# EAGLE design USBReallyTinyISPv1 (EAGLE 7.4.0)
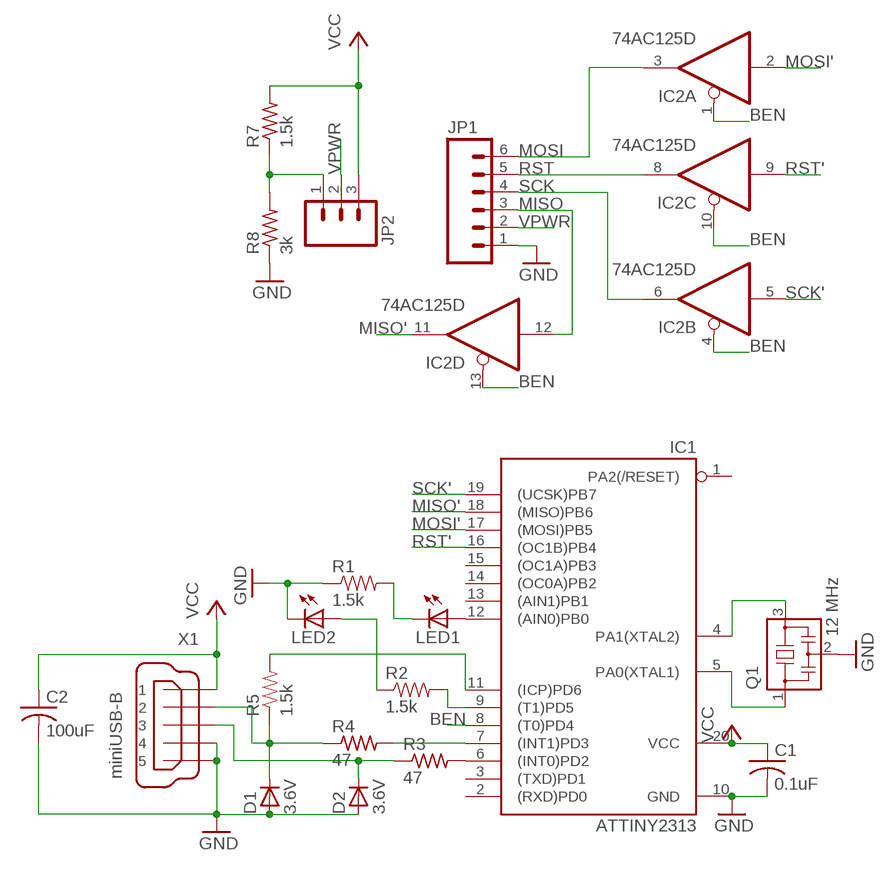
[diagram p0: schematic, sheet 1]

## Parts
C1  0.1uF  C-USC0805  [C0805]
C2  100uF  C-USC1206  [C1206]
D1  3.6V  DIODE_SOD-123  [SOD3718X135N]
D2  3.6V  DIODE_SOD-123  [SOD3718X135N]
IC1  ATTINY2313  TINY2313-*S*  [SO20L$]
IC2  74AC125D  [SO14]
JP1  M06SILK_FEMALE_PTH  [1X06]
JP2  M03-SHORTEDPTH  [1X03]
LED1  LEDSML0805  [SML0805]
LED2  LEDSML0805  [SML0805]
Q1  12 MHz  CSTCR6M00G53Z  [CSTCR6M]
R1  1.5k  RESISTOR1206  [1206]
R2  1.5k  RESISTOR1206  [1206]
R3  47  R-US_R0805  [R0805]
R4  47  R-US_R0805  [R0805]
R5  1.5k  RESISTOR1206  [1206]
R7  1.5k  R-US_R0805  [R0805]
R8  3k  R-US_R0805  [R0805]
X1  miniUSB-B  MINI-USB-UX60A-MB-5ST  [UX60A-MB-5ST]

## Nets
BEN: IC1.8((T0)PD4) IC2.1(A:OE) IC2.4(B:OE) IC2.10(C:OE) IC2.13(D:OE)
GND: C1.2 C2.2 D1.A D2.A IC1.10(GND) JP1.1 LED2.C Q1.2 R1.1 R8.1 X1.4 X1.5
MISO: IC2.12(D:I) JP1.3
MISO': IC1.18((MISO)PB6) IC2.11(D:O)
MOSI: IC2.3(A:O) JP1.6
MOSI': IC1.17((MOSI)PB5) IC2.2(A:I)
N$1: IC1.12((AIN0)PB0) LED1.A
N$2: IC1.4(PA1(XTAL2)) Q1.3
N$3: IC1.5(PA0(XTAL1)) Q1.1
N$4: IC1.9((T1)PD5) R2.2
N$6: LED2.A R2.1
N$7: LED1.C R1.2
N$8: IC1.6((INT0)PD2) R3.2
N$9: IC1.7((INT1)PD3) R4.2
N$10: D2.K R3.1 X1.3
N$11: D1.K R4.1 R5.1 X1.2
N$14: IC1.11((ICP)PD6) R5.2
N$15: JP2.1 R7.1 R8.2
RST: IC2.8(C:O) JP1.5
RST': IC1.16((OC1B)PB4) IC2.9(C:I)
SCK: IC2.6(B:O) JP1.4
SCK': IC1.19((UCSK)PB7) IC2.5(B:I)
VCC: C1.1 C2.1 IC1.20(VCC) JP2.3 R7.2 X1.1
VPWR: JP1.2 JP2.2
Unconnected: IC1.1(PA2(/RESET)) IC1.2((RXD)PD0) IC1.3((TXD)PD1) IC1.13((AIN1)PB1) IC1.14((OC0A)PB2) IC1.15((OC1A)PB3)

## Power pins joined to a net without a drawn wire
GND: IC2.7(P:GND)
VCC: IC2.14(P:VCC)

## Library data of the parts
C1 = adafruit:C-US: CAPACITOR, American symbol
C2 = resistor:C-US: CAPACITOR, American symbol
D1 D2 = ipc-7351-diode:DIODE_
IC1 = avr-7:TINY2313*: Atmel Tiny2313 2K Flash, 128 bytes EEPROM, 128 bytes RAM
IC2 = 74xx-eu:74*125: Quad bus BUFFER, 3-state
JP1 = SparkFun-Connectors:M06: Header 6 Standard 6-pin 0.1" header. Use with straight break away headers (SKU : PRT-00116), right angle break away headers (PRT-00553), swiss pins (PRT-00743), machine pins (PRT-00117), and female headers (PRT-00115). Molex polarized connector foot print use with SKU : PRT-08094 with associated crimp pins and housings. NOTES ON THE VARIANTS LOCK and LOCK_LONGPADS... This footprint was designed to help hold the alignment of a through-hole component (i.e. 6-pin header) while soldering it into place. You may notice that each hole has been shifted either up or down by 0.005 of an inch from it's more standard position (which is a perfectly straight line). This slight alteration caused the pins (the squares in the middle) to touch the edges of the holes. Because they are alternating, it causes a "brace" to hold the component in place. 0.005 has proven to be the perfect amount of "off-center" position when using our standard breakaway headers. Although looks a little odd when you look at the bare footprint, once you have a header in there, the alteration is very hard to notice. Also,if you push a header all the way into place, it is covered up entirely on the bottom side. This idea of altering the position of holes to aid alignment will be further integrated into the Sparkfun Library for other footprints. It can help hold any component with 3 or more connection pins.; PROD_ID: CONN-08437
JP2 = mine:M03-SHORTED: Header 3 Standard 3-pin 0.1" header. Use with straight break away headers (SKU : PRT-00116), right angle break away headers (PRT-00553), swiss pins (PRT-00743), machine pins (PRT-00117), and female headers (PRT-00115). Molex polarized connector foot print use with SKU : PRT-08232 with associated crimp pins and housings.
LED1 LED2 = led:LED: LED OSRAM: - CHIPLED LG R971, LG N971, LY N971, LG Q971, LY Q971, LO R971, LY R971 LH N974, LH R974 LS Q976, LO Q976, LY Q976 LO Q996 - Hyper CHIPLED LW Q18S LB Q993, LB Q99A, LB R99A - SideLED LS A670, LO A670, LY A670, LG A670, LP A670 LB A673, LV A673, LT A673, LW A673 LH A674 LY A675 LS A676, LA A676, LO A676, LY A676, LW A676 LS A679, LY A679, LG A679 - Hyper Micro SIDELED® LS Y876, LA Y876, LO Y876, LY Y876 LT Y87S - SmartLED LW L88C, LW L88S LB L89C, LB L89S, LG L890 LS L89K, LO L89K, LY L89K LS L896, LA L896, LO L896, LY L896 - TOPLED LS T670, LO T670, LY T670, LG T670, LP T670 LSG T670, LSP T670, LSY T670, LOP T670, LYG T670 LG T671, LOG T671, LSG T671 LB T673, LV T673, LT T673, LW T673 LH T674 LS T676, LA T676, LO T676, LY T676, LB T676, LH T676, LSB T676, LW T676 LB T67C, LV T67C, LT T67C, LS T67K, LO T67K, LY T67K, LW E67C LS E67B, LA E67B, LO E67B, LY E67B, LB E67C, LV E67C, LT E67C LW T67C LS T679, LY T679, LG T679 LS T770, LO T770, LY T770, LG T770, LP T770 LB T773, LV T773, LT T773, LW T773 LH T774 LS E675, LA E675, LY E675, LS T675 LS T776, LA T776, LO T776, LY T776, LB T776 LHGB T686 LT T68C, LB T68C - Hyper Mini TOPLED® LB M676 - Mini TOPLED Santana® LG M470 LS M47K, LO M47K, LY M47K Source: http://www.osram.convergy.de LUXEON: - LUMILED® LXK2-PW12-R00, LXK2-PW12-S00, LXK2-PW14-U00, LXK2-PW14-V00 LXK2-PM12-R00, LXK2-PM12-S00, LXK2-PM14-U00 LXK2-PE12-Q00, LXK2-PE12-R00, LXK2-PE12-S00, LXK2-PE14-T00, LXK2-PE14-U00 LXK2-PB12-K00, LXK2-PB12-L00, LXK2-PB12-M00, LXK2-PB14-N00, LXK2-PB14-P00, LXK2-PB14-Q00 LXK2-PR12-L00, LXK2-PR12-M00, LXK2-PR14-Q00, LXK2-PR14-R00 LXK2-PD12-Q00, LXK2-PD12-R00, LXK2-PD12-S00 LXK2-PH12-R00, LXK2-PH12-S00 LXK2-PL12-P00, LXK2-PL12-Q00, LXK2-PL12-R00 Source: www.luxeon.com KINGBRIGHT: KA-3528ASYC Source: www.kingbright.com
Q1 = murata-filter:CSTCR: Resonator Source: murata.co.jp; MPN: CSTCR6M00G53-R0; OC_FARNELL: 1170434; OC_NEWARK: 25M8759
R1 R2 R5 = SparkFun-Resistors:RESISTOR: Resistor Basic schematic elements and footprints for 0603, 1206, and PTH resistors.
R3 R4 R7 R8 = resistor:R-US_: RESISTOR, American symbol
X1 = con-hirose:MINI-USB-: MINI USB Connector Source: http://www.hirose.co.jp/cataloge_hp/e24000019.pdf; OC_FARNELL: unknown; OC_NEWARK: unknown

## Board
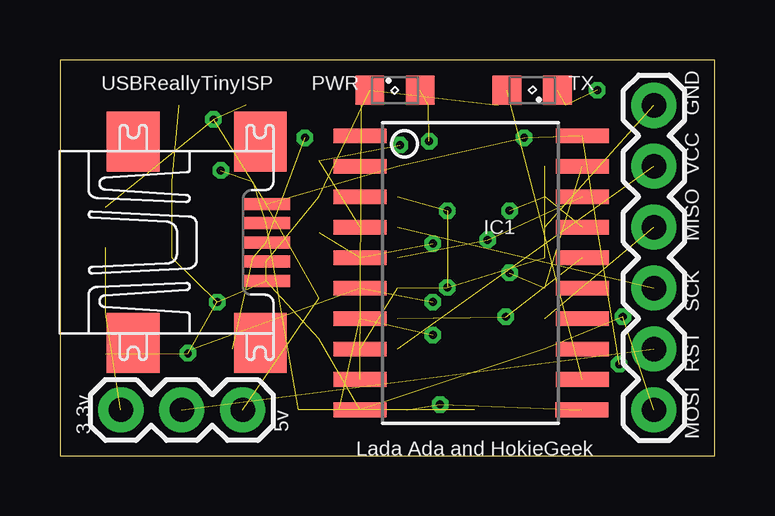
[diagram p1: board, top side]
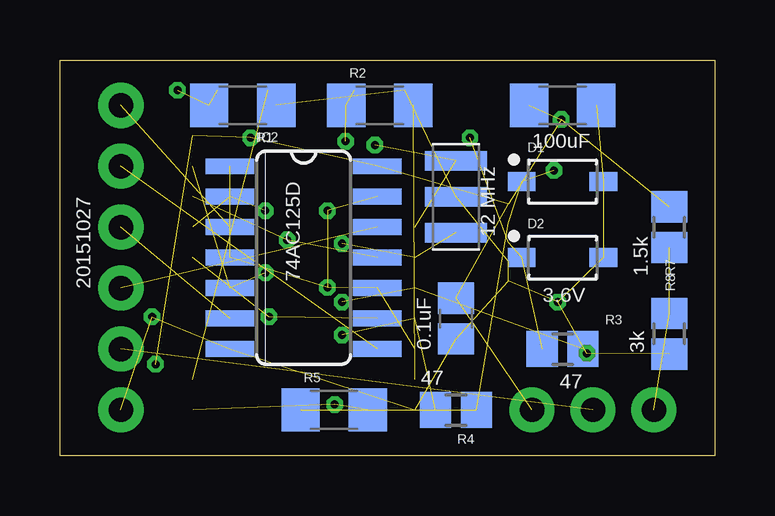
[diagram p2: board, bottom side, seen from below]

Size 27.3 x 16.5 mm. Coordinates in mm from the lower left corner, seen from the top.
Outline: 0,0 27.3,0 27.3,16.5 0,16.5 0,0
Copper layers (1*16): Top 0.0356mm / dielectric 1.5011mm / Bottom 0.0356mm
Design rules "LaenPCBOrder": minimum track width 6mil, minimum drill 13mil, track to track 6mil, track to pad 6mil, pad to pad 6mil, via to via 6mil, smd to smd 6mil, copper to edge 15mil, drill to drill 6mil, minimum pad ring 7mil, minimum via ring 7mil, stop-mask expansion 3mil, vias tented up to drill 0mil, thermal gap 10mil

### Footprints (pad centres in the part's own frame; a part is rotated, then mirrored left to right if it is on the bottom)
C0805 = smd 1.3 x 1.5: 1 -0.85,0; 2 0.85,0
C1206 = smd 1.6 x 1.8: 1 -1.4,0; 2 1.4,0
SOD3718X135N = smd 1.15 x 0.8: A 1.7,0; K -1.7,0
SO20L$ = smd 0.61 x 2.21: 1 -5.715,-4.636; 2 -4.445,-4.636; 3 -3.175,-4.636; 4 -1.905,-4.636; 5 -0.635,-4.636; 6 0.635,-4.636; 7 1.905,-4.636; 8 3.175,-4.636; 9 4.445,-4.636; 10 5.715,-4.636; 11 5.715,4.61; 12 4.445,4.636; 13 3.175,4.636; 14 1.905,4.636; 15 0.635,4.636; 16 -0.635,4.636; 17 -1.905,4.636; 18 -3.175,4.636; 19 -4.445,4.636; 20 -5.715,4.636
SO14 = smd 0.66 x 2.032: 1 -3.81,-3.073; 2 -2.54,-3.073; 3 -1.27,-3.073; 4 0,-3.073; 5 1.27,-3.073; 6 2.54,-3.073; 7 3.81,-3.073; 8 3.81,3.073; 9 2.54,3.073; 10 1.27,3.073; 11 0,3.073; 12 -1.27,3.073; 13 -2.54,3.073; 14 -3.81,3.073
1X06 = drill 1.016 pad 1.88: 1 0,0; 2 2.54,0; 3 5.08,0; 4 7.62,0; 5 10.16,0; 6 12.7,0
1X03 = drill 1.016 pad 1.88: 1 0,0; 2 2.54,0; 3 5.08,0
SML0805 = smd 1.2 x 1.2: A 1.05,0; C -1.05,0
CSTCR6M = smd 0.8 x 2.6: 1 -1.5,0; 2 0,0; 3 1.5,0
1206 = smd 1.6 x 1.8: 1 -1.4,0; 2 1.4,0
R0805 = smd 1.3 x 1.5: 1 -0.85,0; 2 0.85,0
UX60A-MB-5ST = smd 2 x 0.5: 1 2.25,1.6; 2 2.25,0.8; 3 2.25,0; 4 2.25,-0.8; 5 2.25,-1.6 | smd 2.2 x 2.5: M1 -3.3,-4.2; M2 -3.3,4.2; M3 2,4.2; M4 2,-4.2

### Placement (x,y rotation side)
C1  10.79,5.71 270 bottom
C2  6.35,14.61 0 bottom
D1  6.35,11.43 0 bottom
D2  6.35,8.26 0 bottom
IC1  17.14,7.62 270 top
IC2  17.14,8.26 270 bottom
JP1  24.77,1.91 90 top
JP2  2.54,1.91 0 top
LED1  19.68,15.24 180 top
LED2  13.97,15.24 0 top
Q1  10.79,10.79 90 bottom
R1  19.68,14.61 180 bottom
R2  13.97,14.61 0 bottom
R3  6.35,4.45 0 bottom
R4  10.79,1.91 180 bottom
R5  15.88,1.91 0 bottom
R7  1.91,9.53 90 bottom
R8  1.91,5.08 90 bottom
X1  6.35,8.89 0 top

### Tracks (layer width: path | path; a pad name or v marks a point on that pad's centre or on a via)
BEN  (via drill 0.33)  (6 unrouted)
  other vias: 16.15,7.01 16.15,10.21
GND  (via drill 0.33)  (15 unrouted)
  other vias: 23.47,5.79 5.33,4.27 6.55,6.4
MISO  (1 unrouted)
MISO'  (via drill 0.33)  (2 unrouted)
  other vias: 17.83,8.99
MOSI  (1 unrouted)
MOSI'  (via drill 0.33)  (2 unrouted)
  other vias: 18.75,10.21
N$1  (1 unrouted)
N$2  (via drill 0.33)  (2 unrouted)
  other vias: 14.17,12.95
N$3  (via drill 0.33)  (2 unrouted)
  other vias: 15.54,8.84
N$4  (1 unrouted)
N$6  (via drill 0.33)  (2 unrouted)
  other vias: 15.39,13.11
N$7  (via drill 0.33)  (2 unrouted)
  other vias: 22.4,15.24
N$8  (via drill 0.33)  (2 unrouted)
  other vias: 15.54,6.4
N$9  (via drill 0.33)  (2 unrouted)
  other vias: 15.54,5.03
N$10  (via drill 0.33)  (3 unrouted)
  other vias: 10.21,13.26
N$11  (via drill 0.33)  (4 unrouted)
  other vias: 6.71,11.89
N$14  (via drill 0.33)  (2 unrouted)
  other vias: 15.85,2.13
N$15  (2 unrouted)
RST  (1 unrouted)
RST'  (via drill 0.33)  (2 unrouted)
  other vias: 18.59,5.79
SCK  (1 unrouted)
SCK'  (via drill 0.33)  (2 unrouted)
  other vias: 18.75,7.62
VCC  (via drill 0.33)  (9 unrouted)
  other vias: 23.32,3.81 6.4,14.02 19.35,13.26
VPWR  (1 unrouted)

### Text on the board
tPlace: USBReallyTinyISP | PWR | TX | GND | VCC | MISO | SCK | RST | 3.3v | 5v | MOSI | Lada Ada and HokieGeek
bPlace: 20151027